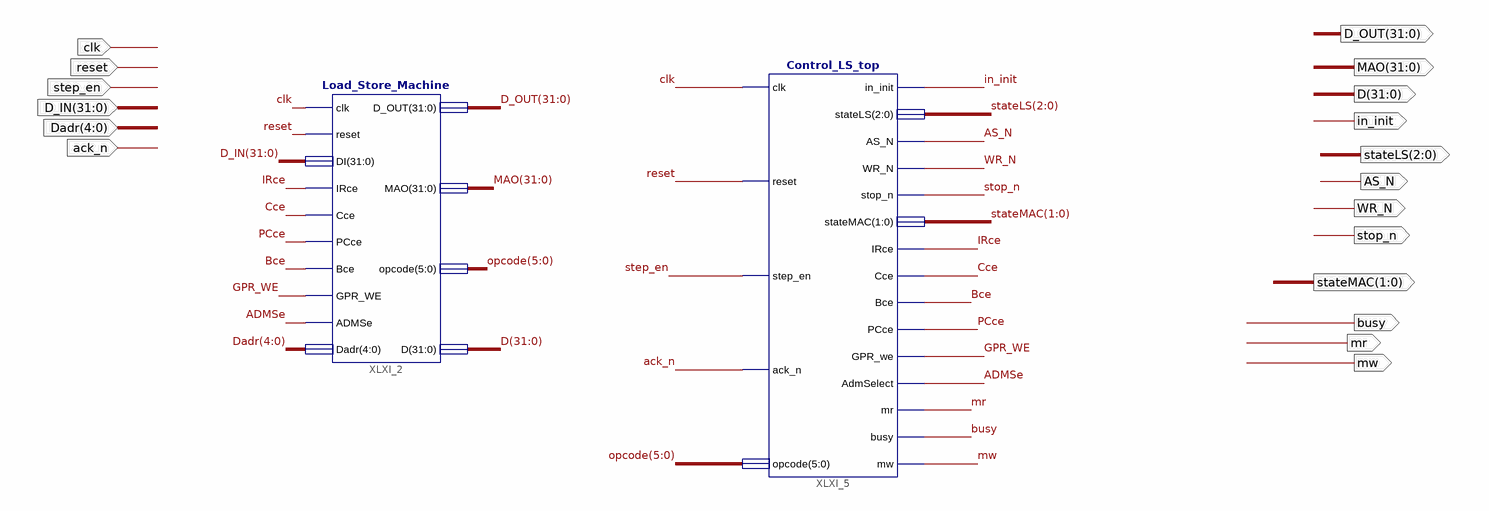
[diagram p0: schematic sheet 1]
// Xilinx ISE schematic Load_Store_Machine_top.sch (spartan6) as structural Verilog: 2 symbols, 18 ports
module Load_Store_Machine_top (
  input  clk,
  input  reset,
  input  step_en,
  input  [31:0] D_IN,
  input  ack_n,
  input  [4:0] Dadr,
  output [2:0] stateLS,
  output in_init,
  output [31:0] D_OUT,
  output [31:0] D,
  output [31:0] MAO,
  output AS_N,
  output WR_N,
  output stop_n,
  output [1:0] stateMAC,
  output busy,
  output mr,
  output mw
);

  wire ADMSe, Bce, Cce, GPR_WE, IRce, PCce;
  wire [5:0] opcode;

  Load_Store_Machine XLXI_2 (
    .clk(clk), .reset(reset), .DI(D_IN), .IRce(IRce), .Cce(Cce), .PCce(PCce), .Bce(Bce), .GPR_WE(GPR_WE),
    .ADMSe(ADMSe), .Dadr(Dadr), .D_OUT(D_OUT), .MAO(MAO), .opcode(opcode), .D(D));
  Control_LS_top XLXI_5 (
    .clk(clk), .reset(reset), .step_en(step_en), .ack_n(ack_n), .opcode(opcode), .in_init(in_init),
    .stateLS(stateLS), .AS_N(AS_N), .WR_N(WR_N), .stop_n(stop_n), .stateMAC(stateMAC), .IRce(IRce),
    .Cce(Cce), .Bce(Bce), .PCce(PCce), .GPR_we(GPR_WE), .AdmSelect(ADMSe), .mr(mr), .busy(busy), .mw(mw));
endmodule
